# EAGLE design Transponder Proaut V5 (EAGLE 7.7.0)
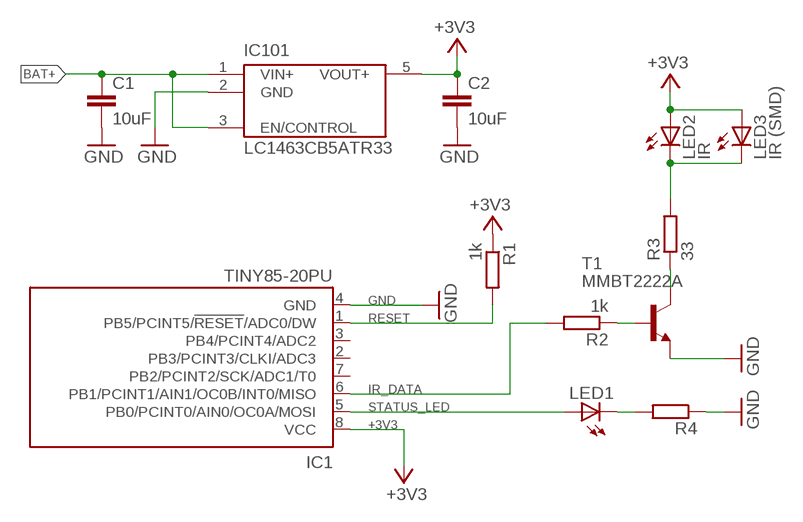
[diagram p0: schematic, sheet 1]

## Parts
C1  10uF  C-EUC0805K  [C0805K]
C2  10uF  C-EUC0805K  [C0805K]
IC1  TINY85-20PU  TINY13-20SU  [8S2]
IC101  LC1463CB5ATR33  LP3990  [SOT23-5]
LED1  LEDCHIPLED_0805  [CHIPLED_0805]
LED2  IR  LED5MM  [LED5MM]
LED3  IR (SMD)  LEDCHIPLED_0805  [CHIPLED_0805]
R1  1k  R-EU_R0805  [R0805@1]
R2  1k  R-EU_R0805  [R0805@1]
R3  33  R-EU_R0805  [R0805@1]
R4  R-EU_R0805  [R0805@1]
T1  MMBT2222A  MMBT2222ALT1-NPN-SOT23-BEC  [SOT23-BEC]

## Nets
+3V3: C2.1 IC1.8(VCC) IC101.5(VOUT+) LED2.A LED3.A R1.1
BAT+: C1.1 IC101.1(VIN+) IC101.3(EN/CONTROL)
GND [POWER]: C1.2 C2.2 IC1.4(GND) IC101.2(GND) R4.1 T1.E
IR_DATA: IC1.6(PB1/PCINT1/AIN1/OC0B/INT0/MISO) R2.2
N$2: LED2.K(C) LED3.C R3.2
N$3: R3.1 T1.C
N$4: R2.1 T1.B
N$6: LED1.C R4.2
RESET: IC1.1(PB5/PCINT5/!RESET!/ADC0/DW) R1.2
STATUS_LED: IC1.5(PB0/PCINT0/AIN0/OC0A/MOSI) LED1.A
Unconnected: IC1.2(PB3/PCINT3/CLKI/ADC3) IC1.3(PB4/PCINT4/ADC2) IC1.7(PB2/PCINT2/SCK/ADC1/T0)

## Library data of the parts
C1 C2 = rcl:C-EU: CAPACITOR, European symbol; OC_FARNELL: 2346925; OC_PROAUT: E005285
IC1 = atmel:TINY13: 8-bit AVR Microcontroller with 1K Bytes In-System Programmable Flash Source: http://www.atmel.com/dyn/resources/prod_documents/2535S.pdf; MPN: ATTINY13-20SU; OC_FARNELL: 9171568; OC_NEWARK: 96K6522
IC101 = power:LP3990; OC_PROAUT: E005094
LED1-LED3 = led:LED: LED OSRAM: - CHIPLED LG R971, LG N971, LY N971, LG Q971, LY Q971, LO R971, LY R971 LH N974, LH R974 LS Q976, LO Q976, LY Q976 LO Q996 - Hyper CHIPLED LW Q18S LB Q993, LB Q99A, LB R99A - SideLED LS A670, LO A670, LY A670, LG A670, LP A670 LB A673, LV A673, LT A673, LW A673 LH A674 LY A675 LS A676, LA A676, LO A676, LY A676, LW A676 LS A679, LY A679, LG A679 - Hyper Micro SIDELED® LS Y876, LA Y876, LO Y876, LY Y876 LT Y87S - SmartLED LW L88C, LW L88S LB L89C, LB L89S, LG L890 LS L89K, LO L89K, LY L89K LS L896, LA L896, LO L896, LY L896 - TOPLED LS T670, LO T670, LY T670, LG T670, LP T670 LSG T670, LSP T670, LSY T670, LOP T670, LYG T670 LG T671, LOG T671, LSG T671 LB T673, LV T673, LT T673, LW T673 LH T674 LS T676, LA T676, LO T676, LY T676, LB T676, LH T676, LSB T676, LW T676 LB T67C, LV T67C, LT T67C, LS T67K, LO T67K, LY T67K, LW E67C LS E67B, LA E67B, LO E67B, LY E67B, LB E67C, LV E67C, LT E67C LW T67C LS T679, LY T679, LG T679 LS T770, LO T770, LY T770, LG T770, LP T770 LB T773, LV T773, LT T773, LW T773 LH T774 LS E675, LA E675, LY E675, LS T675 LS T776, LA T776, LO T776, LY T776, LB T776 LHGB T686 LT T68C, LB T68C - Hyper Mini TOPLED® LB M676 - Mini TOPLED Santana® LG M470 LS M47K, LO M47K, LY M47K Source: http://www.osram.convergy.de LUXEON: - LUMILED® LXK2-PW12-R00, LXK2-PW12-S00, LXK2-PW14-U00, LXK2-PW14-V00 LXK2-PM12-R00, LXK2-PM12-S00, LXK2-PM14-U00 LXK2-PE12-Q00, LXK2-PE12-R00, LXK2-PE12-S00, LXK2-PE14-T00, LXK2-PE14-U00 LXK2-PB12-K00, LXK2-PB12-L00, LXK2-PB12-M00, LXK2-PB14-N00, LXK2-PB14-P00, LXK2-PB14-Q00 LXK2-PR12-L00, LXK2-PR12-M00, LXK2-PR14-Q00, LXK2-PR14-R00 LXK2-PD12-Q00, LXK2-PD12-R00, LXK2-PD12-S00 LXK2-PH12-R00, LXK2-PH12-S00 LXK2-PL12-P00, LXK2-PL12-Q00, LXK2-PL12-R00 Source: www.luxeon.com KINGBRIGHT: KA-3528ASYC Source: www.kingbright.com
R1-R4 = rcl:R-EU_: RESISTOR, European symbol
T1 = transistor:*-NPN-: NPN Transistror BF959 corrected 2008.03.06

## Net classes
0 default: width 0.254 mm, drill 0.406 mm, clearance 0.203 mm
1 POWER: width 0.508 mm, clearance 0.102 mm

## Board
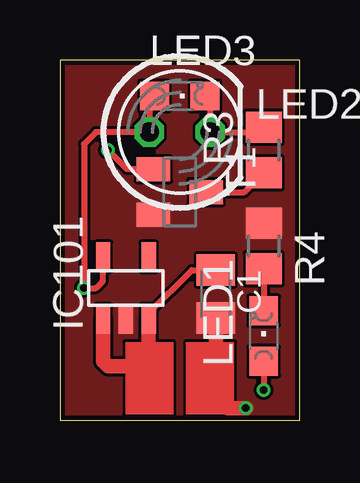
[diagram p1: board, top side]
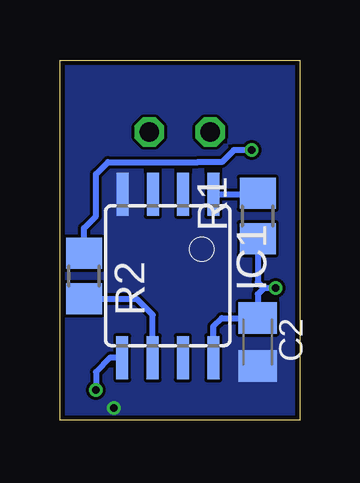
[diagram p2: board, bottom side, seen from below]

Size 10 x 15 mm. Coordinates in mm from the lower left corner, seen from the top.
Outline: 0,10 0,1.5 0,0.25 0,0 1.5,0 8.5,0 10,0 10,1.5 10,10 10,14 10,15 5,15 0,15 0,14 0,10
Copper layers (1*16): Top 0.018mm / dielectric 1.55mm / Bottom 0.018mm
Design rules "Multi-CB_2L_125um-Tracks_OL35um": minimum track width 0.125mm, minimum drill 0.2mm, track to track 0.125mm, track to pad 0.125mm, pad to pad 0.125mm, via to via 0.125mm, smd to smd 0mil, copper to edge 0.2mm, drill to drill 0.2mm, minimum pad ring 0.125mm, minimum via ring 0.125mm, stop-mask expansion 2mil, vias tented up to drill 0.45mm, thermal gap 0.2mm

### Footprints (pad centres in the part's own frame; a part is rotated, then mirrored left to right if it is on the bottom)
C0805K = smd 1.3 x 1.6: 1 -1,0; 2 1,0
8S2 = smd 0.5 x 1.8: 1 -1.905,-3.404; 2 -0.645,-3.404; 3 0.625,-3.404; 4 1.895,-3.404; 5 1.905,3.404; 6 0.635,3.404; 7 -0.635,3.404; 8 -1.905,3.404
SOT23-5 = smd 0.6 x 1.2: 1 -0.95,-1.306; 2 0,-1.306; 3 0.95,-1.306; 4 0.95,1.306; 5 -0.95,1.306
CHIPLED_0805 = smd 1.2 x 1.2: A 0,-1.05; C 0,1.05
LED5MM = drill 0.813 octagon: A -1.27,0; K 1.27,0
R0805@1 = smd 1.3 x 1.5: 1 -0.95,0; 2 0.95,0
SOT23-BEC = smd 1 x 1.4: B -0.95,-1.1; C 0,1.1; E 0.95,-1.1

### Placement (x,y rotation side)
C1  6.5,5.25 270 top
C2  1.75,3.25 270 bottom
IC1  5.5,6 180 bottom
IC101  2.75,5.5 0 top
LED1  8.5,3.5 0 top
LED2  5,12 0 top
LED3  5,13.5 270 top
R1  1.75,8.5 90 bottom
R2  9,6 270 bottom
R3  8.5,11.25 90 top
R4  8.5,7.25 270 top
T1  5,9.5 270 top

### Tracks (layer width: path | path; a pad name or v marks a point on that pad's centre or on a via)
+3V3  (via drill 0.3)
  Top 0.254: LED3.A 3.73,13.5 LED2.A 3.5,12 1.5,12 1,11.5 v1,5.5 1.5,5.5 1.75,5.75 1.8,5.8 IC101.5
  Bottom 0.254: 1.95,7.55 R1.1 1.75,5.75 1.5,5.5 | v1,5.5 1.5,5.5 | 1.5,5.5 1.75,5.25 C2.1 3.25,4.25 3.6,3.9 IC1.8
BAT+
  Top 0.254: 3.75,1.25 3.75,2.25 3.7,2.3 3.65,2.25 | IC101.3 3.7,4.45 5.5,6.25 C1.1
  Top 0.61: IC101.3 3.7,2.3 | IC101.1 1.8,2.45 2,2.25 3.65,2.25
GND  (via drill 0.3)
  Top 0.254: 6.5,2.75 6.27,2.52 6.27,1.25 7.02,0.5
  Top 0.61: C1.2 6.5,2.75 | 7.02,0.5 v7.75,0.5
  pour Bottom (no thermals): -0.5,-0.5 10.5,-0.5 10.5,15.5 -0.5,15.5
  pour Top (no thermals): -0.5,-0.5 10.5,-0.5 10.5,15.5 -0.5,15.5
IR_DATA
  Bottom 0.254: R2.2 6.8,5.05 6.25,4.5 6.13,4.38 IC1.6
N$2
  Top 0.254: LED3.C 6.27,13.5 LED2.K 8,12 R3.2
N$3
  Top 0.254: T1.C 7.7,9.5 R3.1
N$4  (via drill 0.3)
  Top 0.254: T1.B 2.8,10.45 v2,11.25
  Bottom 0.254: v2,11.25 2.75,11.25 3.25,10.75 4.25,10.75 8,10.75 8.5,10.25 8.5,8.5 9,8 R2.1
N$6
  Top 0.254: R4.2 LED1.C
RESET
  Bottom 0.254: IC1.1 1.8,9.4 R1.2
STATUS_LED  (via drill 0.3)
  Top 0.254: LED1.A v8.5,1.25
  Bottom 0.254: IC1.5 7.9,2.6 8.5,2 v8.5,1.25
(copper drawn outside any net)
  shapes: Top area x2